# Altium schematic sheet Keymap.SchDoc
size B; DocumentNumber: 2; SheetNumber: 2; SheetTotal: 3
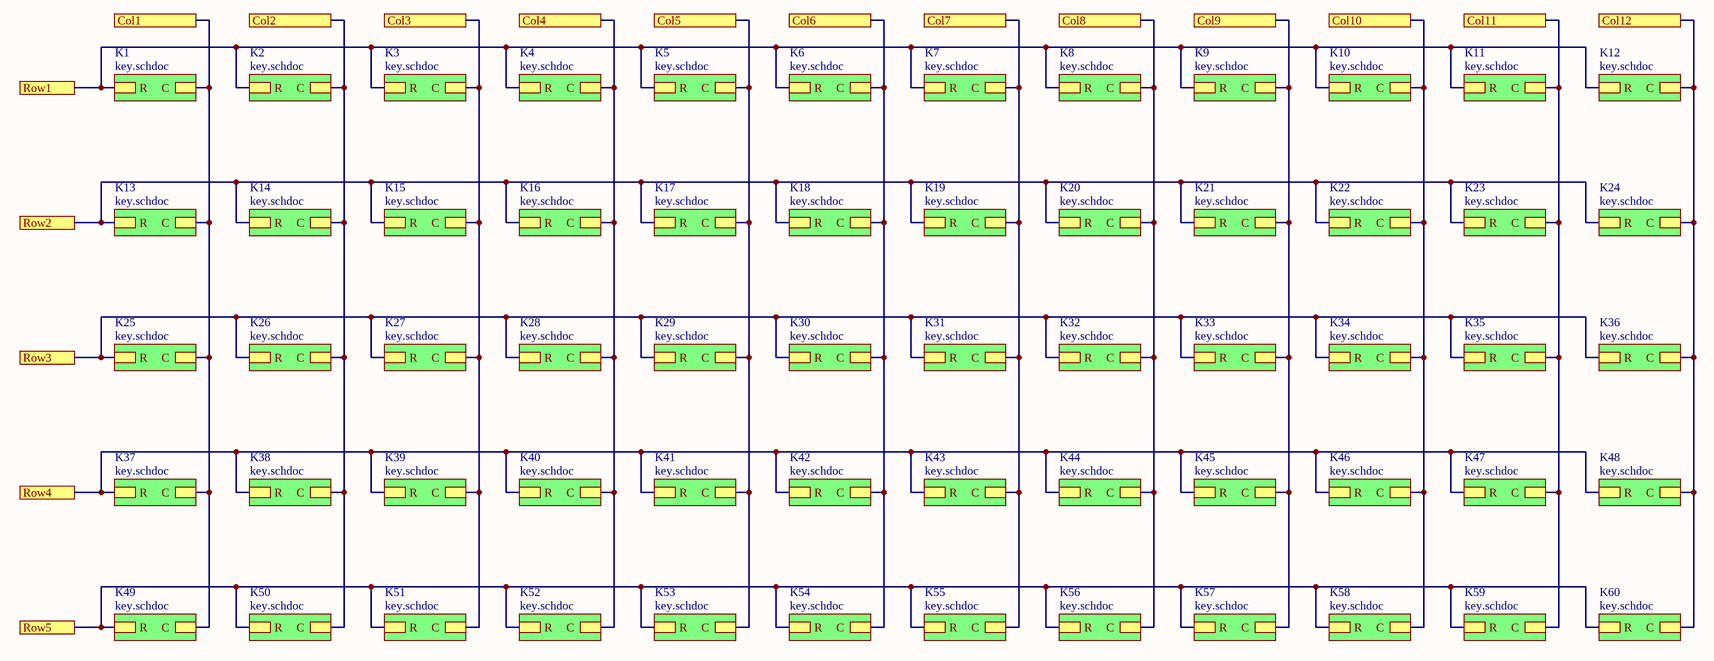
[diagram p0: Keymap.SchDoc]

## Sub-sheets
K1 = key.schdoc: R, C
K2 = key.schdoc: R, C
K3 = key.schdoc: R, C
K4 = key.schdoc: R, C
K5 = key.schdoc: R, C
K6 = key.schdoc: R, C
K7 = key.schdoc: R, C
K8 = key.schdoc: R, C
K9 = key.schdoc: R, C
K10 = key.schdoc: R, C
K11 = key.schdoc: R, C
K12 = key.schdoc: R, C
K13 = key.schdoc: R, C
K14 = key.schdoc: R, C
K15 = key.schdoc: R, C
K16 = key.schdoc: R, C
K17 = key.schdoc: R, C
K18 = key.schdoc: R, C
K19 = key.schdoc: R, C
K20 = key.schdoc: R, C
K21 = key.schdoc: R, C
K22 = key.schdoc: R, C
K23 = key.schdoc: R, C
K24 = key.schdoc: R, C
K25 = key.schdoc: R, C
K26 = key.schdoc: R, C
K27 = key.schdoc: R, C
K28 = key.schdoc: R, C
K29 = key.schdoc: R, C
K30 = key.schdoc: R, C
K31 = key.schdoc: R, C
K32 = key.schdoc: R, C
K33 = key.schdoc: R, C
K34 = key.schdoc: R, C
K35 = key.schdoc: R, C
K36 = key.schdoc: R, C
K37 = key.schdoc: R, C
K38 = key.schdoc: R, C
K39 = key.schdoc: R, C
K40 = key.schdoc: R, C
K41 = key.schdoc: R, C
K42 = key.schdoc: R, C
K43 = key.schdoc: R, C
K44 = key.schdoc: R, C
K45 = key.schdoc: R, C
K46 = key.schdoc: R, C
K47 = key.schdoc: R, C
K48 = key.schdoc: R, C
K49 = key.schdoc: R, C
K50 = key.schdoc: R, C
K51 = key.schdoc: R, C
K52 = key.schdoc: R, C
K53 = key.schdoc: R, C
K54 = key.schdoc: R, C
K55 = key.schdoc: R, C
K56 = key.schdoc: R, C
K57 = key.schdoc: R, C
K58 = key.schdoc: R, C
K59 = key.schdoc: R, C
K60 = key.schdoc: R, C

## Ports
Col1, Col2, Col3, Col4, Col5, Col6, Col7, Col8, Col9, Col10, Col11, Col12, Row1, Row2, Row3, Row4, Row5

## Nets
Col1: port Col1, sheet K1/C, sheet K13/C, sheet K25/C, sheet K37/C, sheet K49/C
Col2: port Col2, sheet K2/C, sheet K14/C, sheet K26/C, sheet K38/C, sheet K50/C
Col3: port Col3, sheet K3/C, sheet K15/C, sheet K27/C, sheet K39/C, sheet K51/C
Col4: port Col4, sheet K4/C, sheet K16/C, sheet K28/C, sheet K40/C, sheet K52/C
Col5: port Col5, sheet K5/C, sheet K17/C, sheet K29/C, sheet K41/C, sheet K53/C
Col6: port Col6, sheet K6/C, sheet K18/C, sheet K30/C, sheet K42/C, sheet K54/C
Col7: port Col7, sheet K7/C, sheet K19/C, sheet K31/C, sheet K43/C, sheet K55/C
Col8: port Col8, sheet K8/C, sheet K20/C, sheet K32/C, sheet K44/C, sheet K56/C
Col9: port Col9, sheet K9/C, sheet K21/C, sheet K33/C, sheet K45/C, sheet K57/C
Col10: port Col10, sheet K10/C, sheet K22/C, sheet K34/C, sheet K46/C, sheet K58/C
Col11: port Col11, sheet K11/C, sheet K23/C, sheet K35/C, sheet K47/C, sheet K59/C
Col12: port Col12, sheet K12/C, sheet K24/C, sheet K36/C, sheet K48/C, sheet K60/C
Row1: port Row1, sheet K1/R, sheet K2/R, sheet K3/R, sheet K4/R, sheet K5/R, sheet K6/R, sheet K7/R, sheet K8/R, sheet K9/R, sheet K10/R, sheet K11/R, sheet K12/R
Row2: port Row2, sheet K13/R, sheet K14/R, sheet K15/R, sheet K16/R, sheet K17/R, sheet K18/R, sheet K19/R, sheet K20/R, sheet K21/R, sheet K22/R, sheet K23/R, sheet K24/R
Row3: port Row3, sheet K25/R, sheet K26/R, sheet K27/R, sheet K28/R, sheet K29/R, sheet K30/R, sheet K31/R, sheet K32/R, sheet K33/R, sheet K34/R, sheet K35/R, sheet K36/R
Row4: port Row4, sheet K37/R, sheet K38/R, sheet K39/R, sheet K40/R, sheet K41/R, sheet K42/R, sheet K43/R, sheet K44/R, sheet K45/R, sheet K46/R, sheet K47/R, sheet K48/R
Row5: port Row5, sheet K49/R, sheet K50/R, sheet K51/R, sheet K52/R, sheet K53/R, sheet K54/R, sheet K55/R, sheet K56/R, sheet K57/R, sheet K58/R, sheet K59/R, sheet K60/R